# EAGLE design controller (EAGLE 9.2.2)
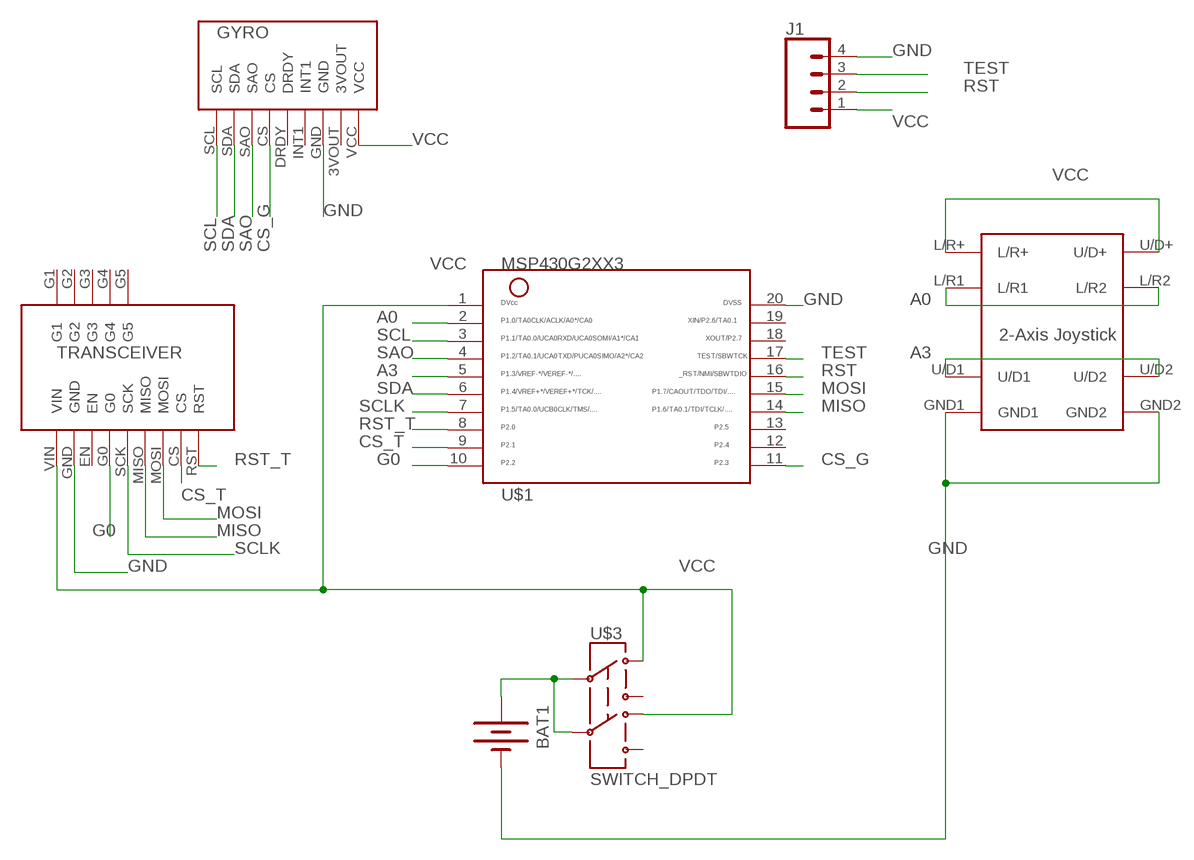
[diagram p0: schematic, sheet 1]

## Parts
BAT1  BATTERY  [BATTERY_PACK_2AA]
J1  CONN_04LOCK  [1X04_LOCK]
U$1  MSP430G2XX3TSSOP  [PW20]
U$2  PARALLAX-2AXIS-JOYSTICK  [PARALLAX-2AXIS-JOYSTICK]
U$3  SWITCH_DPDT  [JS_DPDT_TH]
U$4  ADAFRUIT-RFM69HCW-TRANSCEIVER  [ADAFRUIT-RFM69HCW-TRANSCEIVER]
U$5  GYRO  [GYRO]

## Nets
A0: U$1.2 U$2.L/R1 U$2.L/R2
A3: U$1.5 U$2.U/D1 U$2.U/D2
CS_G: U$1.11 U$5.CS
CS_T: U$1.9 U$4.CS
G0: U$1.10 U$4.G0
GND: BAT1.GND(-) J1.4 U$1.20 U$2.GND1 U$2.GND2 U$4.GND U$5.GND
MISO: U$1.14 U$4.MISO
MOSI: U$1.15 U$4.MOSI
N$2: BAT1.3V(+) U$3.2 U$3.5
RST: J1.2 U$1.16
RST_T: U$1.8 U$4.RST
SAO: U$1.4 U$5.SAO
SCL: U$1.3 U$5.SCL
SCLK: U$1.7 U$4.SCK
SDA: U$1.6 U$5.SDA
TEST: J1.3 U$1.17
VCC: J1.1 U$1.1 U$2.L/R+ U$2.U/D+ U$3.1 U$3.4 U$4.VIN U$5.VCC
Unconnected: U$1.12 U$1.13 U$1.18 U$1.19 U$3.3 U$3.6 U$4.EN U$4.G1 U$4.G2 U$4.G3 U$4.G4 U$4.G5 U$5.3VOUT U$5.DRDY U$5.INT1

## Library data of the parts
BAT1 = ELEC327:BATTERY: Battery Holders Various common sizes : AA, AAA, 20mm coin cell and 12mm coin cell. 20MM_4LEGS, BATT-10373
J1 = SparkFun-Connectors:CONN_04: Multi connection point. Often used as Generic Header-pin footprint for 0.1 inch spaced/style header connections On any of the 0.1 inch spaced packages, you can populate with these: Break Away Headers - Straight <https://www.sparkfun.com/products/116> (PRT-00116) Break Away Male Headers - Right Angle <https://www.sparkfun.com/products/553> (PRT-00553) Female Headers <https://www.sparkfun.com/products/115> (PRT-00115) Break Away Headers - Machine Pin <https://www.sparkfun.com/products/117> (PRT-00117) Break Away Female Headers - Swiss Machine Pin <https://www.sparkfun.com/products/743> (PRT-00743) For SCREWTERMINALS and SPRING TERMINALS visit here: Screw Terimnals on SparkFun.com <https://www.sparkfun.com/search/results?term=Screw+Terminals> (5mm/3.5mm/2.54mm spacing) This device is also useful as a general connection point to wire up your design to another part of your project. Our various solder wires solder well into these plated through hole pads. Hook-Up Wire - Assortment (Stranded, 22 AWG) <https://www.sparkfun.com/products/11375> (PRT-11375) Hook-Up Wire - Assortment (Solid Core, 22 AWG) <https://www.sparkfun.com/products/11367> (PRT-11367) View the entire wire category on our website here <https://www.sparkfun.com/categories/141> Special notes: Molex polarized connector foot print use with SKU : PRT-08231 with associated crimp pins and housings. 1MM SMD Version SKU: PRT-10208; PROD_ID: CONN-09696
U$1 = ELEC327:MSP430G2XX3: MSP430G2XX3 PDIP (N) 20 Pin Package
U$2 = patrickELEC327:PARALLAX-2AXIS-JOYSTICK
U$3 = ELEC327:SWITCH_DPDT
U$4 = patrickELEC327:ADAFRUIT-RFM69HCW-TRANSCEIVER
U$5 = patrickELEC327:GYRO

## Board
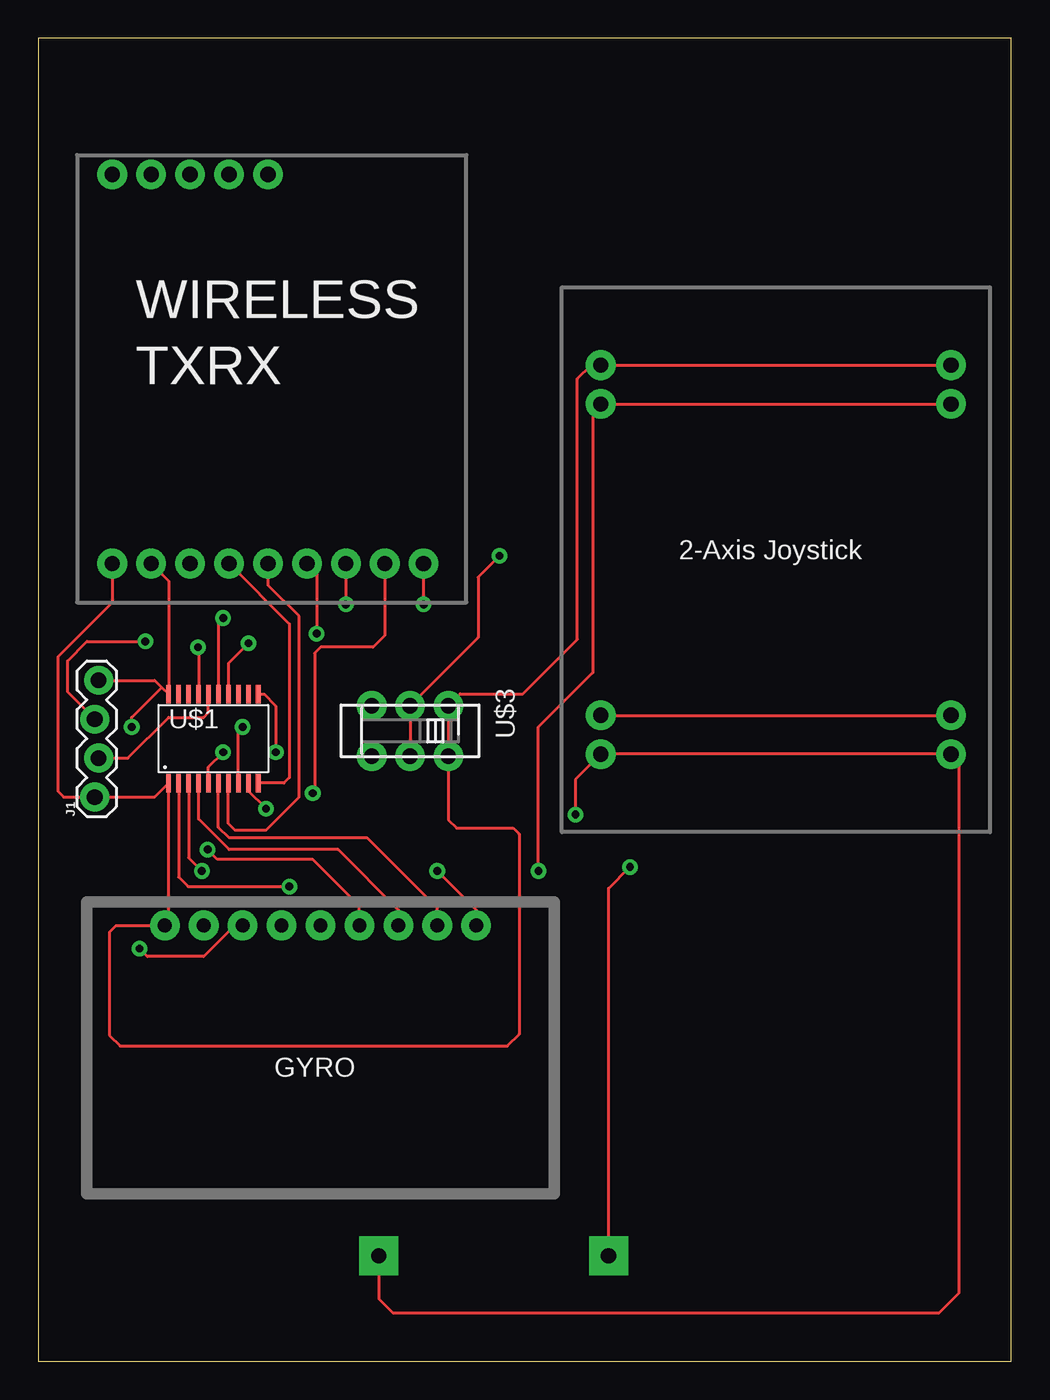
[diagram p1: board, top side]
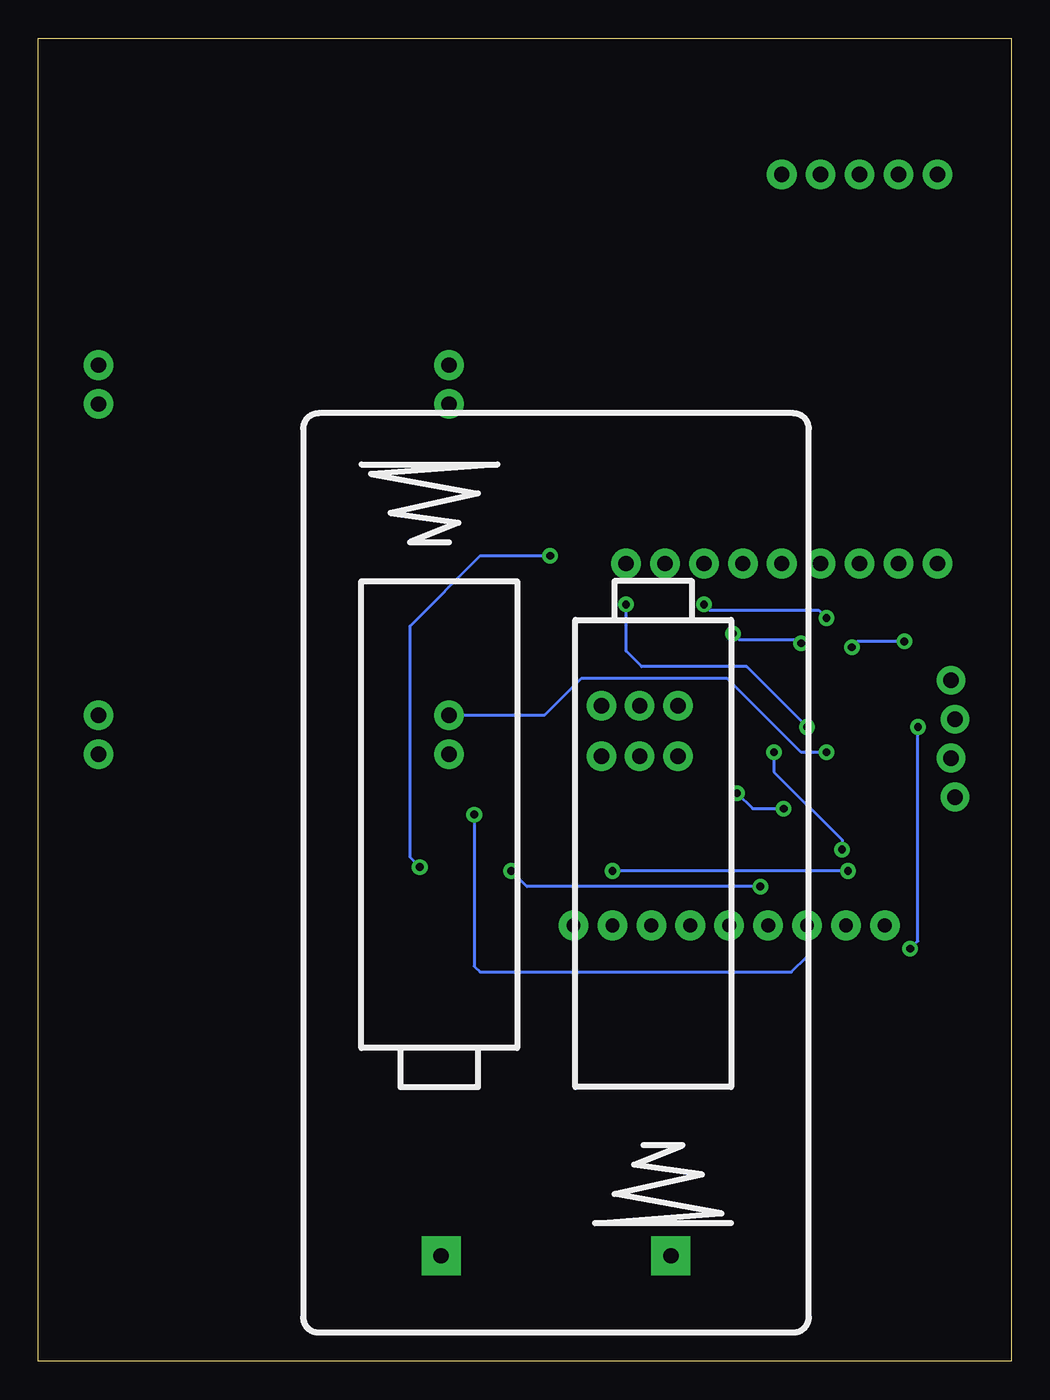
[diagram p2: board, bottom side, seen from below]

Size 63.5 x 86.36 mm. Coordinates in mm from the lower left corner, seen from the top.
Outline: 0,0 63.5,0 63.5,86.36 0,86.36 0,0
Copper layers (1*16): Top 0.035mm / dielectric 1.5mm / Bottom 0.035mm
Design rules "AdvancedCircuitsBarebones": minimum track width 6mil, minimum drill 20mil, track to track 6mil, track to pad 6mil, pad to pad 6mil, via to via 6mil, smd to smd 6mil, copper to edge 10mil, drill to drill 6mil, minimum pad ring 12mil, minimum via ring 10mil, stop-mask expansion 4mil, vias tented up to drill 25mil, thermal gap 10mil

### Footprints (pad centres in the part's own frame; a part is rotated, then mirrored left to right if it is on the bottom)
BATTERY_PACK_2AA = drill 1 pad 2.54 square: 3V 7.5,25; GND -7.5,25
1X04_LOCK = drill 1.016 pad 1.88: 1 0,0.127; 2 2.54,-0.127; 3 5.08,0.127; 4 7.62,-0.127
PW20 = smd 0.3 x 1.2: 1 -2.925,-2.9; 2 -2.275,-2.9; 3 -1.625,-2.9; 4 -0.975,-2.9; 5 -0.325,-2.9; 6 0.325,-2.9; 7 0.975,-2.9; 8 1.625,-2.9; 9 2.275,-2.9; 10 2.925,-2.9; 11 2.925,2.9; 12 2.275,2.9; 13 1.625,2.9; 14 0.975,2.9; 15 0.325,2.9; 16 -0.325,2.9; 17 -0.975,2.9; 18 -1.625,2.9; 19 -2.275,2.9; 20 -2.925,2.9
PARALLAX-2AXIS-JOYSTICK = drill 1 pad 1.93: GND1 0,-25.4; GND2 22.86,-25.4; L/R1 0,-2.54; L/R2 22.86,-2.54; L/R+ 0,0; U/D1 0,-22.86; U/D2 22.86,-22.86; U/D+ 22.86,0
JS_DPDT_TH = drill 1 pad 1.93: 1 -2.5,-1.65; 2 0,-1.65; 3 2.5,-1.65; 4 -2.5,1.65; 5 0,1.65; 6 2.5,1.65
ADAFRUIT-RFM69HCW-TRANSCEIVER = drill 1 pad 1.93: CS 20.066,-26.67; EN 7.366,-26.67; G0 9.906,-26.67; G1 2.286,-1.27; G2 4.826,-1.27; G3 7.366,-1.27; G4 9.906,-1.27; G5 12.446,-1.27; GND 4.826,-26.67; MISO 14.986,-26.67; MOSI 17.526,-26.67; RST 22.606,-26.67; SCK 12.446,-26.67; VIN 2.286,-26.67
GYRO = drill 0.9 pad 1.93: 3VOUT 22.86,-17.526; CS 12.7,-17.526; DRDY 15.24,-17.526; GND 20.32,-17.526; INT1 17.78,-17.526; SAO 10.16,-17.526; SCL 5.08,-17.526; SDA 7.62,-17.526; VCC 25.4,-17.526

### Placement (x,y rotation side)
BAT1  29.72,31.88 180 bottom
J1  3.81,36.83 90 top
U$1  11.43,40.64 0 top
U$2  36.7,65.02 0 top
U$3  24.26,41.15 180 top
U$4  2.54,78.74 0 top
U$5  33.66,10.92 180 top

### Tracks (layer width: path | path; a pad name or v marks a point on that pad's centre or on a via)
A0  (via drill 0.51)
  Top 0.203: U$1.2 9.15,31.61 9.78,30.99 v16.38,30.99 | v32.64,32 32.64,41.4 36.2,44.96 36.2,61.98 U$2.L/R1 U$2.L/R2
  Bottom 0.203: v16.38,30.99 31.62,30.99 v32.64,32
A3  (via drill 0.51)
  Top 0.203: U$1.5 11.11,38.79 v12.06,39.75 | U$2.U/D1 U$2.U/D2
  Bottom 0.203: v12.06,39.75 13.72,39.75 18.54,44.58 28.07,44.58 30.48,42.16 U$2.U/D1
CS_G  (via drill 0.51)
  Top 0.203: U$5.CS 20.95,29.72 17.91,32.77 11.68,32.77 v11.05,33.4 | v15.49,39.75 15.49,42.78 14.74,43.54 U$1.11
  Bottom 0.203: v11.05,33.4 11.05,34.04 15.49,38.48 v15.49,39.75
CS_T  (via drill 0.51)
  Top 0.203: U$4.CS 22.61,47.37 21.84,46.61 18.41,46.61 18.03,46.23 18.03,37.21 v17.91,37.08 | v14.86,36.07 13.71,37.22 U$1.9
  Bottom 0.203: v17.91,37.08 16.89,36.07 v14.86,36.07
G0
  Top 0.203: U$4.G0 16.38,48.13 16.38,38.1 16.02,37.74 U$1.10
GND  (via drill 0.51)
  Top 0.203: J1.4 7.59,44.45 8.05,43.99 | 8.05,43.99 U$1.20 8.51,50.93 U$4.GND | U$5.GND 12.83,28.45 10.79,26.42 7.11,26.42 v6.6,26.92 | v6.1,41.4 6.1,42.04 8.05,43.99 | v35.05,35.69 35.05,37.97 U$2.GND1 U$2.GND2 60.07,39.12 60.07,4.45 58.8,3.17 23.11,3.17 22.22,4.07 BAT1.GND
  Bottom 0.203: v6.6,26.92 6.1,27.43 v6.1,41.4 | v35.05,35.69 35.05,25.78 34.67,25.4 14.35,25.4 13.34,26.42 U$5.GND
MISO  (via drill 0.51)
  Top 0.203: U$4.MISO 18.16,51.44 v18.16,47.5 | v13.72,46.86 12.4,45.55 U$1.14
  Bottom 0.203: v18.16,47.5 17.78,47.12 13.97,47.12 v13.72,46.86
MOSI  (via drill 0.51)
  Top 0.203: U$4.MOSI v20.07,49.4 | v12.06,48.51 11.76,48.2 U$1.15
  Bottom 0.203: v20.07,49.4 19.68,49.02 12.57,49.02 v12.06,48.51
N$2  (via drill 0.51)
  Top 0.203: U$3.5 U$3.2 28.7,47.24 28.7,51.18 v30.1,52.58 | BAT1.3V 37.22,30.87 v38.61,32.26
  Bottom 0.203: v38.61,32.26 39.24,32.89 39.24,48.01 34.67,52.58 v30.1,52.58
RST
  Top 0.203: J1.2 5.84,39.37 8.51,42.04 10.79,42.04 11.11,42.35 U$1.16
RST_T  (via drill 0.51)
  Top 0.203: v25.15,49.4 U$4.RST | U$1.8 13.05,41.12 v13.34,41.4
  Bottom 0.203: v13.34,41.4 17.27,45.34 24.13,45.34 25.15,46.35 v25.15,49.4
SAO
  Top 0.203: U$5.SAO 23.5,29.46 19.56,33.4 12.45,33.4 10.46,35.39 U$1.4
SCL  (via drill 0.51)
  Top 0.203: U$1.3 9.8,32.87 v10.67,32 | v26.04,32 28.57,29.46 U$5.SCL
  Bottom 0.203: v10.67,32 v26.04,32
SCLK
  Top 0.203: U$4.SCK 14.99,50.67 17.02,48.64 17.02,36.83 14.86,34.67 12.83,34.67 12.4,35.09 U$1.7
SDA
  Top 0.203: U$5.SDA 26.04,29.59 21.46,34.16 12.45,34.16 11.76,34.85 U$1.6
TEST  (via drill 0.51)
  Top 0.203: J1.3 1.91,43.69 1.91,45.72 3.17,46.99 v6.99,46.99 | v10.41,46.61 10.46,46.57 U$1.17
  Bottom 0.203: v6.99,46.99 10.03,46.99 v10.41,46.61
VCC
  Top 0.203: U$4.VIN 4.83,49.53 1.27,45.97 1.27,37.21 1.65,36.83 J1.1 7.59,36.83 U$1.1 8.51,28.7 U$5.VCC 5.08,28.45 4.64,28 4.64,21.27 5.33,20.57 30.61,20.57 31.37,21.34 31.37,34.42 30.99,34.8 27.3,34.8 26.76,35.35 U$3.4 U$3.1 27.52,43.56 31.62,43.56 35.18,47.12 35.18,64.14 36.07,65.02 U$2.L/R+ U$2.U/D+